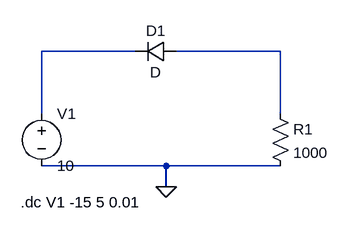
[diagram p0: schematic PN junction RB.asc]
PN junction RB.asc, the LTspice schematic file:
Version 4.1
SHEET 1 880 680
WIRE 112 48 -32 48
WIRE 336 48 176 48
WIRE -32 144 -32 48
WIRE 336 144 336 48
WIRE 160 224 -32 224
WIRE 336 224 160 224
WIRE 160 256 160 224
FLAG 160 256 0
SYMBOL voltage -32 128 R0
WINDOW 123 0 0 Left 0
WINDOW 39 0 0 Left 0
SYMATTR InstName V1
SYMATTR Value 10
SYMBOL diode 176 32 R90
WINDOW 0 0 32 VBottom 2
WINDOW 3 32 32 VTop 2
SYMATTR InstName D1
SYMBOL res 320 128 R0
SYMATTR InstName R1
SYMATTR Value 1000
TEXT -64 280 Left 2 !.dc V1 -15 5 0.01

The netlist it stands for:
* PN junction RB.asc
V1 N001 0 10
D1 N002 N001 D
R1 N002 0 1000
.model D D
.lib standard.dio
.dc V1 -15 5 0.01
.backanno
.end